# Altium schematic sheet TCA8418按键电路.SchDoc
size A4
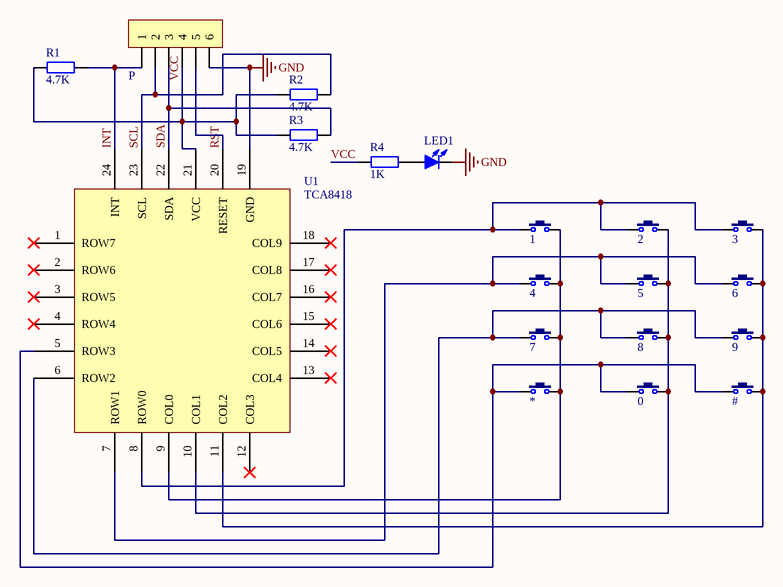
[diagram p0: TCA8418按键电路.SchDoc]

## Parts
0  3x6x5  [TSW SMD-3*6*2.5]  (value not drawn)
1  3x6x5  [TSW SMD-3*6*2.5]  (value not drawn)
2  3x6x5  [TSW SMD-3*6*2.5]  (value not drawn)
3  3x6x5  [TSW SMD-3*6*2.5]  (value not drawn)
4  3x6x5  [TSW SMD-3*6*2.5]  (value not drawn)
5  3x6x5  [TSW SMD-3*6*2.5]  (value not drawn)
6  3x6x5  [TSW SMD-3*6*2.5]  (value not drawn)
7  3x6x5  [TSW SMD-3*6*2.5]  (value not drawn)
8  3x6x5  [TSW SMD-3*6*2.5]  (value not drawn)
9  3x6x5  [TSW SMD-3*6*2.5]  (value not drawn)
#  3x6x5  [TSW SMD-3*6*2.5]  (value not drawn)
*  3x6x5  [TSW SMD-3*6*2.5]  (value not drawn)
LED1  (no value)  [LED 0805B]
P  HDR-1X6  [HDR-1X6]  (value not drawn)
R1  4.7K  [R 0805]
R2  4.7K  [R 0805]
R3  4.7K  [R 0805]
R4  1K  [R 0805]
U1  TCA8418  [QFN24]

## Nets
GND: LED1.2(K) P.6 U1.19(GND)
INT: P.1 R1.2 U1.24(INT)
RST: P.5 U1.20(RESET)
SCL: P.2 R2.2 U1.23(SCL)
SDA: P.3 R3.2 U1.22(SDA)
VCC: P.4 R1.1 R2.1 R3.1 R4.1 U1.21(VCC)
Net0_1: 0.1 #.1 *.1 U1.5(ROW3)
Net0_2: 0.2 2.2 5.2 8.2 U1.10(COL1)
Net1_1: 1.1 2.1 3.1 U1.8(ROW0)
Net1_2: 1.2 4.2 7.2 *.2 U1.9(COL0)
Net3_2: 3.2 6.2 9.2 #.2 U1.11(COL2)
Net4_1: 4.1 5.1 6.1 U1.7(ROW1)
Net7_1: 7.1 8.1 9.1 U1.6(ROW2)
NetLED1_1: LED1.1(A) R4.2

Not connected (* = marked no-connect by the designer): U1 1(ROW7)* 2(ROW6)* 3(ROW5)* 4(ROW4)* 12(COL3)* 13(COL4)* 14(COL5)* 15(COL6)* 16(COL7)* 17(COL8)* 18(COL9)*

## Library data of the parts
0-9 # * = TSW 3x6: 3x6轻触开关; 版权归属: 源创客; BOM名称: 3x6轻触开关; 学习资源: www.ooocke.com
LED1 = LED-SMD: 贴片LED; 版权归属: 源创客; BOM名称: 贴片LED; 学习资源: www.ooocke.com
P = Header 6: 6P接插件; 版权归属: 源创客; BOM名称: 6P接插件; 学习资源: www.ooocke.com
R1-R4 = R: 贴片电阻; 版权归属: 源创客; BOM名称: 贴片电阻; 学习资源: www.ooocke.com
U1 = Component_1